# EAGLE schematic Macropad_v19 (EAGLE 9.7.0)
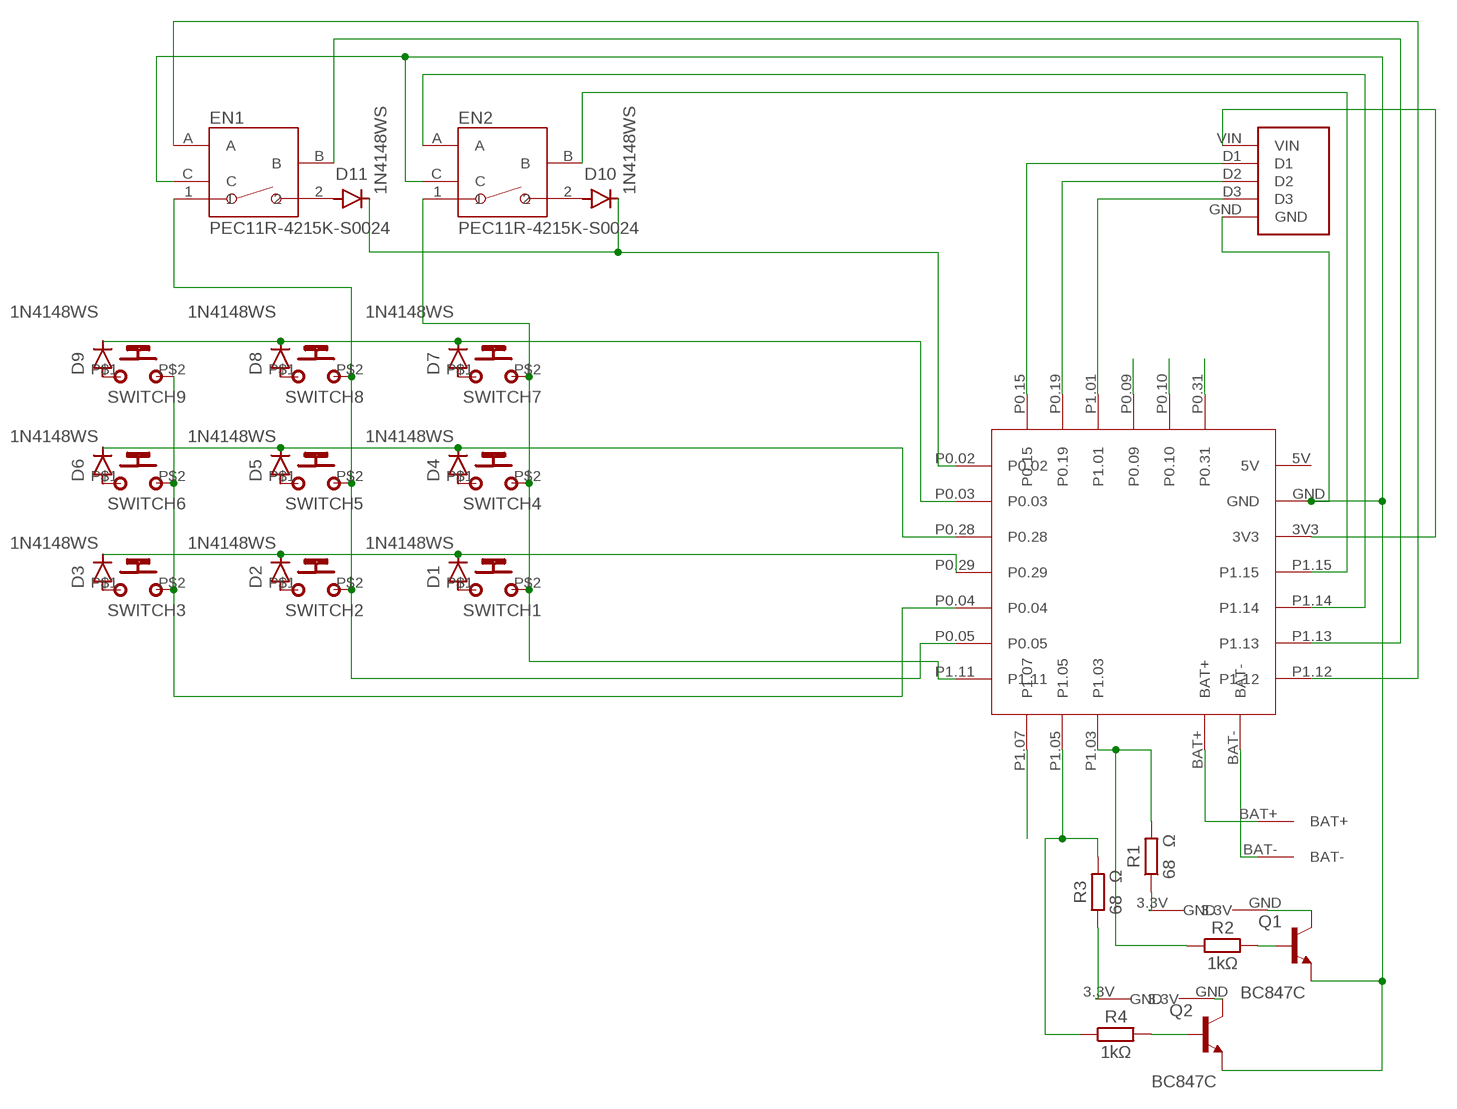
[diagram p0: schematic, sheet 1]

## Parts
D1  1N4148WS  [SOD-323]
D2  1N4148WS  [SOD-323]
D3  1N4148WS  [SOD-323]
D4  1N4148WS  [SOD-323]
D5  1N4148WS  [SOD-323]
D6  1N4148WS  [SOD-323]
D7  1N4148WS  [SOD-323]
D8  1N4148WS  [SOD-323]
D9  1N4148WS  [SOD-323]
D10  1N4148WS  [SOD-323]
D11  1N4148WS  [SOD-323]
EN1  PEC11R-4215K-S0024  [PEC11R-4215K-S0024]
EN2  PEC11R-4215K-S0024  [PEC11R-4215K-S0024]
Q1  BC847C  [TRANS_BC847C]
Q2  BC847C  [TRANS_BC847C]
R1  68 Ω  R_CHIP-0402(1005-METRIC)  [RESC1005X40]
R2  1kΩ  R_CHIP-0402(1005-METRIC)  [RESC1005X40]
R3  68 Ω  R_CHIP-0402(1005-METRIC)  [RESC1005X40]
R4  1kΩ  R_CHIP-0402(1005-METRIC)  [RESC1005X40]
SWITCH1  MX1A-11NN  [CHERRY_MX1A-11NN_SWITCH]
SWITCH2  MX1A-11NN  [CHERRY_MX1A-11NN_SWITCH]
SWITCH3  MX1A-11NN  [CHERRY_MX1A-11NN_SWITCH]
SWITCH4  MX1A-11NN  [CHERRY_MX1A-11NN_SWITCH]
SWITCH5  MX1A-11NN  [CHERRY_MX1A-11NN_SWITCH]
SWITCH6  MX1A-11NN  [CHERRY_MX1A-11NN_SWITCH]
SWITCH7  MX1A-11NN  [CHERRY_MX1A-11NN_SWITCH]
SWITCH8  MX1A-11NN  [CHERRY_MX1A-11NN_SWITCH]
SWITCH9  MX1A-11NN  [CHERRY_MX1A-11NN_SWITCH]
U$1  JST-PH2.0MM  [JST-PH2.0MM]
U$2  5-PIN-POGO-CONNECTOR  [5-PIN-THROUGHHOLE]
U$3  LED-THROUGHHOLE  [LED]
U$4  LED-THROUGHHOLE  [LED]
XIAO_NRF52840_PLUS1  XIAO_NRF52840_PLUS  [XIAO-NRF52840-PLUS-SMD]

## Nets
3.3V: U$2.VIN XIAO_NRF52840_PLUS1.3V3
BAT+ [BAT+]: U$1.BAT+ XIAO_NRF52840_PLUS1.BAT+
BAT- [BAT-]: U$1.BAT- XIAO_NRF52840_PLUS1.BAT-
GND [GND]: EN1.C EN2.C Q1.2(E) Q2.2(E) U$2.GND XIAO_NRF52840_PLUS1.GND
N$1: D1.C D2.C D3.C XIAO_NRF52840_PLUS1.P0.29
N$2: D7.C D8.C D9.C XIAO_NRF52840_PLUS1.P0.03
N$3: EN1.A XIAO_NRF52840_PLUS1.P1.12
N$4: D1.A SWITCH1.P$1(P)
N$5: D2.A SWITCH2.P$1(P)
N$6: D3.A SWITCH3.P$1(P)
N$7: D4.A SWITCH4.P$1(P)
N$8: D5.A SWITCH5.P$1(P)
N$9: D6.A SWITCH6.P$1(P)
N$10: D7.A SWITCH7.P$1(P)
N$11: D8.A SWITCH8.P$1(P)
N$12: D9.A SWITCH9.P$1(P)
N$13: D11.A EN1.2
N$14: D10.A EN2.2
N$15: EN1.B XIAO_NRF52840_PLUS1.P1.13
N$16: EN1.1 SWITCH2.P$2(S) SWITCH5.P$2(S) SWITCH8.P$2(S) XIAO_NRF52840_PLUS1.P0.05
N$17: R1.2 R2.1 XIAO_NRF52840_PLUS1.P1.03
N$18: D4.C D5.C D6.C XIAO_NRF52840_PLUS1.P0.28
N$19: EN2.A XIAO_NRF52840_PLUS1.P1.14
N$20: SWITCH3.P$2(S) SWITCH6.P$2(S) SWITCH9.P$2(S) XIAO_NRF52840_PLUS1.P0.04
N$21: EN2.B XIAO_NRF52840_PLUS1.P1.15
N$22: D10.C D11.C XIAO_NRF52840_PLUS1.P0.02
N$23: EN2.1 SWITCH1.P$2(S) SWITCH4.P$2(S) SWITCH7.P$2(S) XIAO_NRF52840_PLUS1.P1.11
N$24: Q1.3(C) U$3.GND
N$25: Q1.1(B) R2.2
N$26: Q2.1(B) R4.2
N$27: Q2.3(C) U$4.GND
N$28: R3.1 U$4.3.3V
N$29: R1.1 U$3.3.3V
P0.09: XIAO_NRF52840_PLUS1.P0.09
P0.10: XIAO_NRF52840_PLUS1.P0.10
P0.15: U$2.D1 XIAO_NRF52840_PLUS1.P0.15
P0.19: U$2.D2 XIAO_NRF52840_PLUS1.P0.19
P0.31: XIAO_NRF52840_PLUS1.P0.31
P1.01: U$2.D3 XIAO_NRF52840_PLUS1.P1.01
P1.05: R3.2 R4.1 XIAO_NRF52840_PLUS1.P1.05
P1.07: XIAO_NRF52840_PLUS1.P1.07

## Power pins joined to a net without a drawn wire
5V: XIAO_NRF52840_PLUS1.5V

## Library data of the parts
D1-D11 = Diodes-2:1N4148WS: DIODE GEN PURP 75V 150MA SOD323F Manufacturer's datasheet <https://www.onsemi.com/pub/Collateral/1N914BWS-D.pdf>; CREATED_BY: PCBLayout.com; DIGIKEY_PART_NUMBER: 1N4148WSFSTR-ND; MANUFACTURER: Diodes Incorporated; MPN: 1N4148WS; PACKAGE: SOD-323
EN1 EN2 = Encoders:PEC11R-4215K-S0024: ROTARY ENCODER MECHANICAL 24PPR Manufacturer's datasheet <https://www.bourns.com/docs/Product-Datasheets/PEC11R.pdf>; CREATED_BY: PCBLayout.com; DIGIKEY_PARTNO: PEC11R-4215K-S0024-ND; MANUFACTURER: Bourns Inc.; MPN: PEC11R-4215K-S0024
Q1 Q2 = BC847C:BC847C: Check availability <https://pricing.snapeda.com/parts/BC847C/Diotec%20Semiconductor/view-part?ref=eda>; AVAILABILITY: In Stock; CHECK_PRICES: https://www.snapeda.com/parts/BC847C/Diotec/view-part/?ref=eda; DESCRIPTION: BJT, SOT-23, 45V, 100mA, NPN, 0.25W, 150°C; MF: Diotec Semiconductor; MP: BC847C; PACKAGE: SOT-23 Diotec; PRICE: None; SNAPEDA_LINK: https://www.snapeda.com/parts/BC847C/Diotec/view-part/?ref=snap
R1-R4 = Resistor:R: Resistor Fixed - Generic; CATEGORY: Resistor; SUB-CATEGORY: Fixed
SWITCH1-SWITCH9 = MX-RED:MX1A-11NN: Check availability <https://pricing.snapeda.com/parts/MX1A11NN/Cherry/view-part?ref=eda>; AVAILABILITY: In Stock; CHECK_PRICES: https://www.snapeda.com/parts/MX1A11NN/Cherry/view-part/?ref=eda; DESCRIPTION: SWITCH, TACTILE, SPST-NO, 10mA, THOUGH HOLE; Product Range:MX Series; Actuator Orientation:Top Actuated; Switch Mounting:Surface Mount; Actuator Style:Plunger for Cap; Actuating Force:59.5gf; Contact Rating:10mA at 12VDC RoHS Compliant: No; MF: Cherry; MP: MX1A11NN; PACKAGE: None; PRICE: None; SNAPEDA_LINK: https://www.snapeda.com/parts/MX1A11NN/Cherry/view-part/?ref=snap
U$1 = JST-PH 2.0mm:JST-PH2.0MM
U$2 = 5 Pin Pogo Connector:5-PIN-POGO-CONNECTOR
U$3 U$4 = LED-Throughhole:LED-THROUGHHOLE
XIAO_NRF52840_PLUS1 = XIAO-nRF52840-Plus-SMD:XIAO_NRF52840_PLUS

## Net classes
0 default: width 0.5 mm
12 BAT+: width 1.5 mm
13 BAT-: width 1.5 mm
14 3.3V: width 1.5 mm
15 GND: width 1.5 mm